# Altium schematic sheet stm32g4.SchDoc
size A4; SheetNumber: 2; SheetTotal: 11
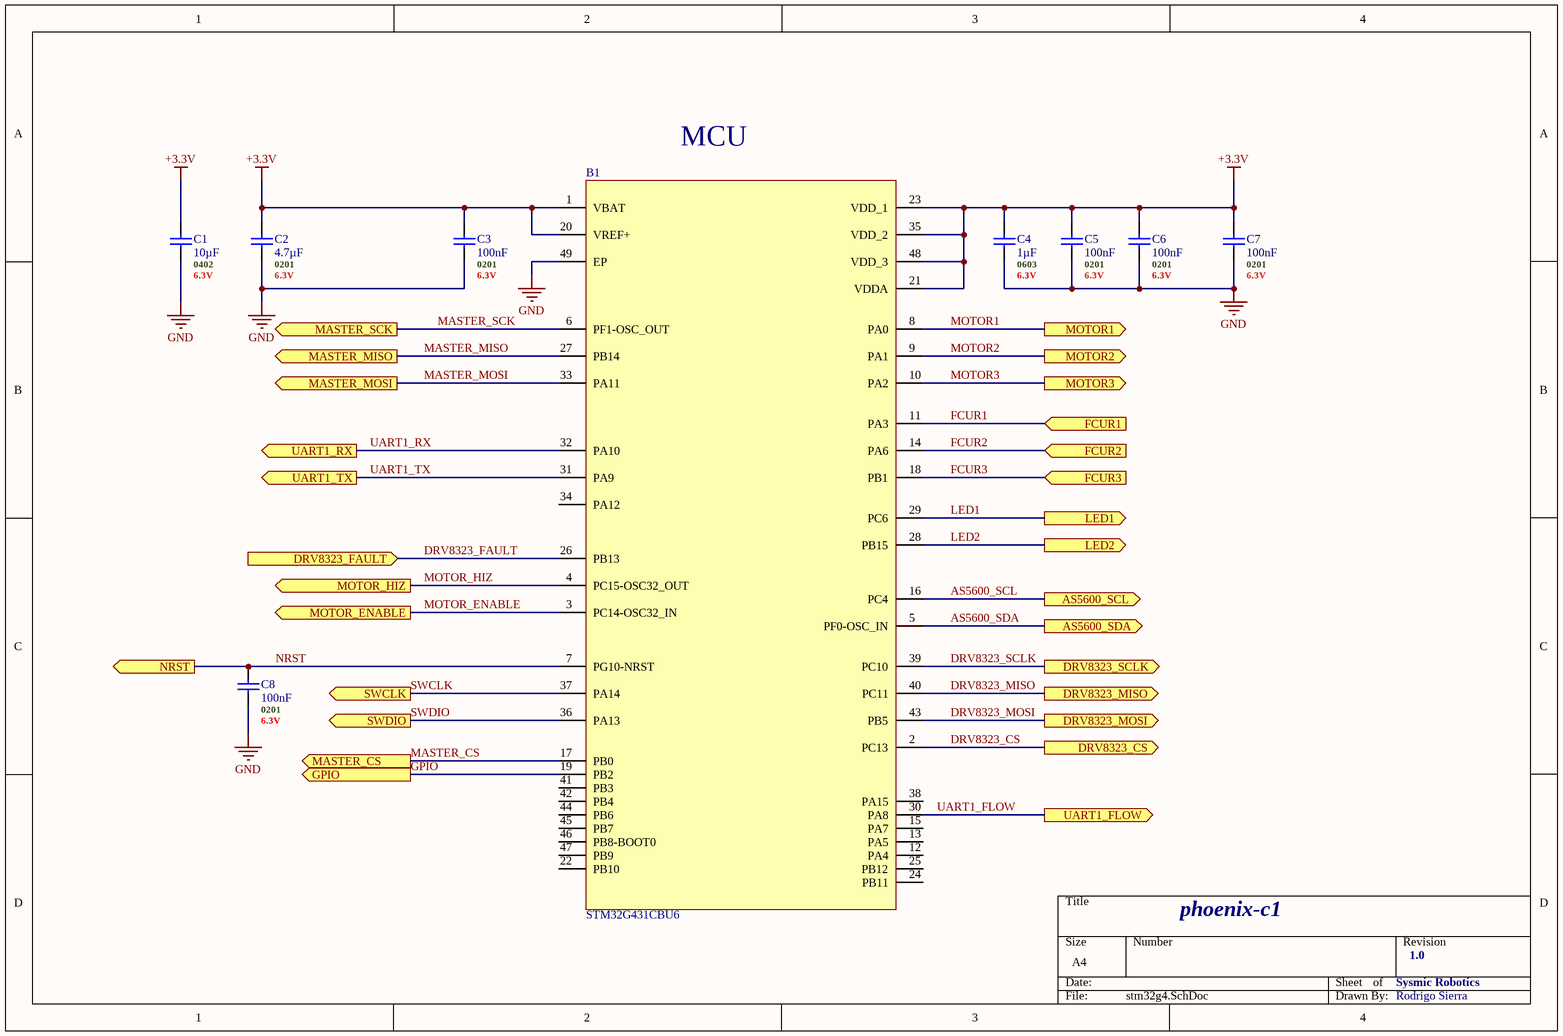
[diagram p0: stm32g4.SchDoc]

## Parts
B1  STM32G431CBU6  [48-UFQFN - STMicroelectronics]
C1  10µF  .Case/Package: 0402  .Voltage Rating (DC): 6.3V  [C0402 - MURATA]
C2  4.7µF  .Case/Package: 0201  .Voltage Rating (DC): 6.3V  [C0201 - MURATA]
C3  100nF  .Case/Package: 0201  .Voltage Rating (DC): 6.3V  [C0201 - MURATA]
C4  1µF  .Case/Package: 0603  .Voltage Rating (DC): 6.3V  [C0603 - MURATA]
C5  100nF  .Case/Package: 0201  .Voltage Rating (DC): 6.3V  [C0201 - MURATA]
C6  100nF  .Case/Package: 0201  .Voltage Rating (DC): 6.3V  [C0201 - MURATA]
C7  100nF  .Case/Package: 0201  .Voltage Rating (DC): 6.3V  [C0201 - MURATA]
C8  100nF  .Case/Package: 0201  .Voltage Rating (DC): 6.3V  [C0201 - MURATA]

## Ports
AS5600_SCL (out, see phoenix-c1-sch[2C], encoder[3B]), AS5600_SDA (out, see phoenix-c1-sch[2C], encoder[3B]), DRV8323_CS (out, see phoenix-c1-sch[3C], gate_driver[1C]), DRV8323_FAULT (in, see phoenix-c1-sch[3C], gate_driver[1C]), DRV8323_MISO (out, see phoenix-c1-sch[3B], gate_driver[1C]), DRV8323_MOSI (out, see phoenix-c1-sch[3C], gate_driver[1C]), DRV8323_SCLK (out, see phoenix-c1-sch[3C], gate_driver[1C]), FCUR1 (in, see phoenix-c1-sch[3C], gate_driver[4B]), FCUR2 (in, see phoenix-c1-sch[3C], gate_driver[4B]), FCUR3 (in, see phoenix-c1-sch[3C], gate_driver[4C]), GPIO (out, see phoenix-c1-sch[2B], external_ports[3C]), LED1 (out, see phoenix-c1-sch[2C], leds[2C]), LED2 (out, see phoenix-c1-sch[2C], leds[3C]), MASTER_CS (out, see phoenix-c1-sch[2B], external_ports[3C]), MASTER_MISO (out, see phoenix-c1-sch[2B], external_ports[3B]), MASTER_MOSI (out, see phoenix-c1-sch[2B], external_ports[3B]), MASTER_SCK (out, see phoenix-c1-sch[2B], external_ports[3B]), MOTOR1 (out, see phoenix-c1-sch[3B], gate_driver[1B]), MOTOR2 (out, see phoenix-c1-sch[3B], gate_driver[1B]), MOTOR3 (out, see phoenix-c1-sch[3B], gate_driver[1C]), MOTOR_ENABLE (out, see phoenix-c1-sch[3B], gate_driver[1B]), MOTOR_HIZ (out, see phoenix-c1-sch[3B], gate_driver[1B]), NRST (out, see phoenix-c1-sch[2B], external_ports[2C]), SWCLK (out, see phoenix-c1-sch[2B], external_ports[2B]), SWDIO (out, see phoenix-c1-sch[2B], external_ports[2C]), UART1_FLOW (out, see phoenix-c1-sch[2B], external_ports[4C]), UART1_RX (out, see phoenix-c1-sch[2B], external_ports[4B]), UART1_TX (out, see phoenix-c1-sch[2B], external_ports[4B])

## Nets
+3.3V: B1.1(VBAT) B1.20(VREF+) B1.21(VDDA) B1.23(VDD_1) B1.35(VDD_2) B1.48(VDD_3) C1.2 C2.2 C3.2 C4.2 C5.2 C6.2 C7.2
GND: B1.49(EP) C1.1 C2.1 C3.1 C4.1 C5.1 C6.1 C7.1 C8.1
AS5600_SCL: B1.16(PC4) ; port AS5600_SCL
AS5600_SDA: B1.5(PF0-OSC_IN) ; port AS5600_SDA
DRV8323_CS: B1.2(PC13) ; port DRV8323_CS
DRV8323_FAULT: B1.26(PB13) ; port DRV8323_FAULT
DRV8323_MISO: B1.40(PC11) ; port DRV8323_MISO
DRV8323_MOSI: B1.43(PB5) ; port DRV8323_MOSI
DRV8323_SCLK: B1.39(PC10) ; port DRV8323_SCLK
FCUR1: B1.11(PA3) ; port FCUR1
FCUR2: B1.14(PA6) ; port FCUR2
FCUR3: B1.18(PB1) ; port FCUR3
GPIO: B1.19(PB2) ; port GPIO
LED1: B1.29(PC6) ; port LED1
LED2: B1.28(PB15) ; port LED2
MASTER_CS: B1.17(PB0) ; port MASTER_CS
MASTER_MISO: B1.27(PB14) ; port MASTER_MISO
MASTER_MOSI: B1.33(PA11) ; port MASTER_MOSI
MASTER_SCK: B1.6(PF1-OSC_OUT) ; port MASTER_SCK
MOTOR1: B1.8(PA0) ; port MOTOR1
MOTOR2: B1.9(PA1) ; port MOTOR2
MOTOR3: B1.10(PA2) ; port MOTOR3
MOTOR_ENABLE: B1.3(PC14-OSC32_IN) ; port MOTOR_ENABLE
MOTOR_HIZ: B1.4(PC15-OSC32_OUT) ; port MOTOR_HIZ
NRST: B1.7(PG10-NRST) C8.2 ; port NRST
SWCLK: B1.37(PA14) ; port SWCLK
SWDIO: B1.36(PA13) ; port SWDIO
UART1_FLOW: B1.30(PA8) ; port UART1_FLOW
UART1_RX: B1.32(PA10) ; port UART1_RX
UART1_TX: B1.31(PA9) ; port UART1_TX

Not connected (* = marked no-connect by the designer): B1 12(PA4) 13(PA5) 15(PA7) 22(PB10) 24(PB11) 25(PB12) 34(PA12) 38(PA15) 41(PB3) 42(PB4) 44(PB6) 45(PB7) 46(PB8-BOOT0) 47(PB9)

## Notes on the sheet
- MCU
- phoenix-c1
- Sysmic Robotics
- 1.0
- Rodrigo Sierra

## Library data of the parts
B1 = STM32G431CBU6: STMICROELECTRONICS - STM32G431CBU6 - MCU, 32BIT, 170MHZ, UFQFPN-48; Geometry.Height: 0.65mm; Mouser Part Number: 511-STM32G431CBU6; Mouser Price/Stock: https://www.mouser.co.uk/ProductDetail/STMicroelectronics/STM32G431CBU6?qs=T3oQrply3y%252B0hTuSHQ7oqA%3D%3D; Manufacturer_Name: STMicroelectronics; Manufacturer_Part_Number: STM32G431CBU6; Datasheet Link: https://www.st.com/resource/en/datasheet/stm32g431cb.pdf; Supplier 1: Mouser; Supplier Part Number 1: 511-STM32G431CBU6
C1 = GRM155R60J106ME05D: Ceramic Capacitor, Ceramic, 6.3V, 20% +Tol, 20% -Tol, X5R, 15% TC, 10uF, Surface Mount, 0402; Manufacturer: Murata; Manufacturer Lifecycle Status: IN PRODUCTION; Supplier: Mouser; Supplier Part Number: 81-GRM155R60J106M05D; Manufacturer Part Number: GRM155R60J106ME05D; RoHS: Compliant; Category: Ceramic Capacitors; Stock: 374888; Pricing: 1=0,1, 10=0,021, 50=0,021, 100=0,019, 1000=0,018, 10000=0,014 (USD); Value: 10µF; Case/Package: 0402; Dielectric: X5R; Dielectric Material: Ceramic; Height: 500µm; Length: 1mm; Lifecycle Status: Production; Material: Ceramic; Max Operating Temperature: 85°C; Min Operating Temperature: -55°C; Mounting Technology: Surface Mount; Number of Terminals: 2; REACH SVHC: Yes; Schedule B: 8532240020|8532240020|8532240020|8532240020|8532240020|8532240020|8532240020|8532240020|8532240020|8532240020|8532240020|8532240020|8532240020|8532240020|8532240020|8532240020|8532240020|8532240020|8532240020|8532240020|8532240020|8532240020|8532240020|85; Thickness: 500µm; Tolerance: 20%; Voltage Rating: 6.3V; Voltage Rating (DC): 6.3V; Width: 500µm; ComponentLink1URL: https://datasheet.octopart.com:443/GRM155R60J106ME05D-Murata-datasheet-155239051.pdf?src-supplier=Newark; ComponentLink1Description: https://datasheet.octopart.com:443/GRM155R60J106ME05D-Murata-datasheet-155239051.pdf?src-supplier=Newark; ComponentLink2URL: https://datasheet.octopart.com:443/GRM155R60J106ME05D-Murata-datasheet-165579666.pdf?src-supplier=TME; ComponentLink2Description: https://datasheet.octopart.com:443/GRM155R60J106ME05D-Murata-datasheet-165579666.pdf?src-supplier=TME; ComponentLink3URL: https://datasheet.octopart.com:443/GRM155R60J106ME05D-Murata-datasheet-141266224.pdf?src-supplier=Ciiva; ComponentLink3Description: https://datasheet.octopart.com:443/GRM155R60J106ME05D-Murata-datasheet-141266224.pdf?src-supplier=Ciiva; ComponentLink4URL: https://datasheet.octopart.com:443/GRM155R60J106ME05D-Murata-datasheet-140689296.pdf?src-supplier=Ciiva; ComponentLink4Description: https://datasheet.octopart.com:443/GRM155R60J106ME05D-Murata-datasheet-140689296.pdf?src-supplier=Ciiva; ComponentLink5URL: https://datasheet.octopart.com:443/GRM155R60J106ME05D-Murata-datasheet-138740637.pdf?src-supplier=Ciiva; ComponentLink5Description: https://datasheet.octopart.com:443/GRM155R60J106ME05D-Murata-datasheet-138740637.pdf?src-supplier=Ciiva; ComponentLink6URL: https://datasheet.octopart.com/GRM155R60J106ME05D-Murata-datasheet-12515295.pdf; ComponentLink6Description: https://datasheet.octopart.com/GRM155R60J106ME05D-Murata-datasheet-12515295.pdf; ComponentLink7URL: https://datasheet.octopart.com/GRM155R60J106ME05D-Murata-datasheet-12510076.pdf; ComponentLink7Description: https://datasheet.octopart.com/GRM155R60J106ME05D-Murata-datasheet-12510076.pdf; ComponentLink8URL: https://datasheet.octopart.com/GRM155R60J106ME05D-Murata-datasheet-11978611.pdf; ComponentLink8Description: https://datasheet.octopart.com/GRM155R60J106ME05D-Murata-datasheet-11978611.pdf; ComponentLink9URL: https://datasheet.octopart.com/GRM155R60J106ME05D-Murata-datasheet-10025737.pdf; ComponentLink9Description: https://datasheet.octopart.com/GRM155R60J106ME05D-Murata-datasheet-10025737.pdf; ComponentLink10URL: https://datasheet.octopart.com/GRM155R60J106ME05D-Murata-datasheet-8819587.pdf; ComponentLink10Description: https://datasheet.octopart.com/GRM155R60J106ME05D-Murata-datasheet-8819587.pdf; ComponentLink11URL: http://sigma.octopart.com:80/reach_statement/Murata-company-16.pdf?src-supplier=Compliance+Statements; ComponentLink11Description: http://sigma.octopart.com:80/reach_statement/Murata-company-16.pdf?src-supplier=Compliance+Statements; Supplier 1: Mouser; Supplier Part Number 1: 81-GRM155R60J106M05D
C2 = GRM035R60J475ME15D: Ceramic Capacitor, Ceramic, 6.3V, 20% +Tol, 20% -Tol, X5R, 15% TC, 4.7uF, Surface Mount, 0201; Manufacturer: Murata; Manufacturer Lifecycle Status: IN PRODUCTION; Supplier: Mouser; Supplier Part Number: 81-GRM035R60J475ME5D; Manufacturer Part Number: GRM035R60J475ME15D; RoHS: Compliant; Category: Ceramic Capacitors; Stock: 788914; Pricing: 1=0,1, 10=0,039, 50=0,039, 100=0,039, 1000=0,039, 10000=0,033 (USD); Value: 4.7µF; Case/Package: 0201; Case Code (Imperial): 0201; Case Code (Metric): 0603; Dielectric: X5R; Dielectric Material: Ceramic; Height: 500µm; Length: 600µm; Lifecycle Status: Production; Material: Ceramic; Max Operating Temperature: 85°C; Min Operating Temperature: -55°C; Mounting Technology: Surface Mount; Number of Terminals: 2; REACH SVHC: Yes; Schedule B: 8532240020, 8532240020|8532240020, 8532240020|8532240020|8532240020, 8532240020|8532240020|8532240020|8532240020; Thickness: 500µm; Tolerance: 20%; Voltage Rating: 6.3V; Voltage Rating (DC): 6.3V; Width: 300µm; ComponentLink1URL: https://datasheet.octopart.com:443/GRM035R60J475ME15D-Murata-datasheet-149522819.pdf?src-supplier=Farnell; ComponentLink1Description: https://datasheet.octopart.com:443/GRM035R60J475ME15D-Murata-datasheet-149522819.pdf?src-supplier=Farnell; ComponentLink2URL: https://datasheet.octopart.com:443/GRM035R60J475ME15D-Murata-datasheet-165579666.pdf?src-supplier=TME; ComponentLink2Description: https://datasheet.octopart.com:443/GRM035R60J475ME15D-Murata-datasheet-165579666.pdf?src-supplier=TME; ComponentLink3URL: https://datasheet.octopart.com:443/GRM035R60J475ME15D-Murata-datasheet-140678601.pdf?src-supplier=Ciiva; ComponentLink3Description: https://datasheet.octopart.com:443/GRM035R60J475ME15D-Murata-datasheet-140678601.pdf?src-supplier=Ciiva; ComponentLink4URL: https://datasheet.octopart.com:443/GRM035R60J475ME15D-Murata-datasheet-140677062.pdf?src-supplier=Ciiva; ComponentLink4Description: https://datasheet.octopart.com:443/GRM035R60J475ME15D-Murata-datasheet-140677062.pdf?src-supplier=Ciiva; ComponentLink5URL: https://datasheet.octopart.com:443/GRM035R60J475ME15D-Murata-datasheet-138738751.pdf?src-supplier=Ciiva; ComponentLink5Description: https://datasheet.octopart.com:443/GRM035R60J475ME15D-Murata-datasheet-138738751.pdf?src-supplier=Ciiva; ComponentLink6URL: https://datasheet.octopart.com:443/GRM035R60J475ME15D-Murata-datasheet-140089765.pdf?src-supplier=Future+Electronics; ComponentLink6Description: https://datasheet.octopart.com:443/GRM035R60J475ME15D-Murata-datasheet-140089765.pdf?src-supplier=Future+Electronics; ComponentLink7URL: https://datasheet.octopart.com/GRM035R60J475ME15D-Murata-datasheet-12515295.pdf; ComponentLink7Description: https://datasheet.octopart.com/GRM035R60J475ME15D-Murata-datasheet-12515295.pdf; ComponentLink8URL: https://datasheet.octopart.com/GRM035R60J475ME15D-Murata-datasheet-12510076.pdf; ComponentLink8Description: https://datasheet.octopart.com/GRM035R60J475ME15D-Murata-datasheet-12510076.pdf; ComponentLink9URL: https://datasheet.octopart.com/GRM035R60J475ME15D-Murata-datasheet-11978611.pdf; ComponentLink9Description: https://datasheet.octopart.com/GRM035R60J475ME15D-Murata-datasheet-11978611.pdf; ComponentLink10URL: https://datasheet.octopart.com/GRM035R60J475ME15D-Murata-datasheet-10025737.pdf; ComponentLink10Description: https://datasheet.octopart.com/GRM035R60J475ME15D-Murata-datasheet-10025737.pdf; ComponentLink11URL: https://datasheet.octopart.com/GRM035R60J475ME15D-Murata-datasheet-8819587.pdf; ComponentLink11Description: https://datasheet.octopart.com/GRM035R60J475ME15D-Murata-datasheet-8819587.pdf; ComponentLink12URL: http://sigma.octopart.com:80/reach_statement/Murata-company-16.pdf?src-supplier=Compliance+Statements; ComponentLink12Description: http://sigma.octopart.com:80/reach_statement/Murata-company-16.pdf?src-supplier=Compliance+Statements; Supplier 1: Mouser; Supplier Part Number 1: 81-GRM035R60J475ME5D
C3 C5-C8 = GRT033R60J104KE01J: Ceramic Capacitor, Multilayer, Ceramic, 6.3V, 10% +Tol, 10% -Tol, X5R, 15% TC, 0.1uF, Surface Mount, 0201; Manufacturer: Murata; Manufacturer Lifecycle Status: IN PRODUCTION; Supplier: Mouser; Supplier Part Number: 81-GRT033R60J104KE1J; Manufacturer Part Number: GRT033R60J104KE01J; RoHS: Compliant; Category: Ceramic Capacitors; Stock: 150000; Pricing: 1=0,1, 10=0,017, 50=0,017, 100=0,014, 1000=0,009, 10000=0,007 (USD); Value: 100nF; Case/Package: 0201; Dielectric Material: Ceramic; Height: 300µm; Length: 600µm; Lifecycle Status: Production; Material: Ceramic; Max Operating Temperature: 85°C; Min Operating Temperature: -55°C; Mounting Technology: Surface Mount; Number of Terminals: 2; REACH SVHC: Yes; Thickness: 300µm; Tolerance: 10%; Voltage Rating: 6.3V; Voltage Rating (DC): 6.3V; Width: 300µm; ComponentLink1URL: https://datasheet.octopart.com:443/GRT033R60J104KE01J-Murata-datasheet-141283033.pdf?src-supplier=Geoflip; ComponentLink1Description: https://datasheet.octopart.com:443/GRT033R60J104KE01J-Murata-datasheet-141283033.pdf?src-supplier=Geoflip; ComponentLink2URL: https://datasheet.octopart.com:443/GRT033R60J104KE01J-Murata-datasheet-140710645.pdf?src-supplier=Ciiva; ComponentLink2Description: https://datasheet.octopart.com:443/GRT033R60J104KE01J-Murata-datasheet-140710645.pdf?src-supplier=Ciiva; ComponentLink3URL: https://datasheet.octopart.com:443/GRT033R60J104KE01J-Murata-datasheet-138748272.pdf?src-supplier=Ciiva; ComponentLink3Description: https://datasheet.octopart.com:443/GRT033R60J104KE01J-Murata-datasheet-138748272.pdf?src-supplier=Ciiva; ComponentLink4URL: http://sigma.octopart.com:80/reach_statement/Murata-company-16.pdf?src-supplier=Compliance+Statements; ComponentLink4Description: http://sigma.octopart.com:80/reach_statement/Murata-company-16.pdf?src-supplier=Compliance+Statements; Supplier 1: Mouser; Supplier Part Number 1: 81-GRT033R60J104KE1J
C4 = GRM188R60J105KA01D: Ceramic Capacitor, Ceramic, 6.3V, 10% +Tol, 10% -Tol, X5R, 15% TC, 1uF, Surface Mount, 0603; Manufacturer: Murata; Manufacturer Lifecycle Status: NRND; Insulation Resistance: 500MΩ; Supplier: Mouser; Supplier Part Number: 81-GRM39R105K6.3; Manufacturer Part Number: GRM188R60J105KA01D; RoHS: Compliant; Category: Ceramic Capacitors; Stock: 153012; Pricing: 1=0,14, 10=0,056, 50=0,056, 100=0,049, 1000=0,035, 10000=0,019 (USD); Value: 1µF; Case/Package: 0603; Case Code (Imperial): 0603; Case Code (Metric): 1608; Depth: 800µm; Dielectric: X5R; Dielectric Material: Ceramic; Height: 800µm; Lead Free: Lead Free; Length: 1.6mm; Lifecycle Status: NRND; Material: Ceramic; Max Operating Temperature: 85°C; Min Operating Temperature: -55°C; Mounting Technology: Surface Mount; Pins: 2; Number of Terminals: 2; Radiation Hardening: No; REACH SVHC: Yes; Schedule B: 8532240020, 8532240020|8532240020, 8532240020|8532240020|8532240020, 8532240020|8532240020|8532240020|8532240020; Termination: SMD/SMT; Thickness: 800µm; Tolerance: 10%; Voltage: 6.3V; Voltage Rating: 6.3V; Voltage Rating (DC): 6.3V; Width: 800µm; ComponentLink1URL: https://datasheet.octopart.com:443/GRM188R60J105KA01D-Murata-datasheet-7599024.pdf?src-supplier=Newark; ComponentLink1Description: https://datasheet.octopart.com:443/GRM188R60J105KA01D-Murata-datasheet-7599024.pdf?src-supplier=Newark; ComponentLink2URL: https://datasheet.octopart.com:443/GRM188R60J105KA01D-Murata-datasheet-101584256.pdf?src-supplier=element14+APAC; ComponentLink2Description: https://datasheet.octopart.com:443/GRM188R60J105KA01D-Murata-datasheet-101584256.pdf?src-supplier=element14+APAC; ComponentLink3URL: https://datasheet.octopart.com:443/GRM188R60J105KA01D-Murata-datasheet-49135294.pdf?src-supplier=element14+APAC; ComponentLink3Description: https://datasheet.octopart.com:443/GRM188R60J105KA01D-Murata-datasheet-49135294.pdf?src-supplier=element14+APAC; ComponentLink4URL: https://datasheet.octopart.com:443/GRM188R60J105KA01D-Murata-datasheet-165579666.pdf?src-supplier=TME; ComponentLink4Description: https://datasheet.octopart.com:443/GRM188R60J105KA01D-Murata-datasheet-165579666.pdf?src-supplier=TME; ComponentLink5URL: https://datasheet.octopart.com:443/GRM188R60J105KA01D-Murata-datasheet-59876780.pdf?src-supplier=TME; ComponentLink5Description: https://datasheet.octopart.com:443/GRM188R60J105KA01D-Murata-datasheet-59876780.pdf?src-supplier=TME; ComponentLink6URL: https://datasheet.octopart.com:443/GRM188R60J105KA01D-Murata-datasheet-140704005.pdf?src-supplier=Ciiva; ComponentLink6Description: https://datasheet.octopart.com:443/GRM188R60J105KA01D-Murata-datasheet-140704005.pdf?src-supplier=Ciiva; ComponentLink7URL: https://datasheet.octopart.com:443/GRM188R60J105KA01D-Murata-datasheet-138742778.pdf?src-supplier=Ciiva; ComponentLink7Description: https://datasheet.octopart.com:443/GRM188R60J105KA01D-Murata-datasheet-138742778.pdf?src-supplier=Ciiva; ComponentLink8URL: https://datasheet.octopart.com:443/GRM188R60J105KA01D-Murata-datasheet-102370999.pdf?src-supplier=Future+Electronics; ComponentLink8Description: https://datasheet.octopart.com:443/GRM188R60J105KA01D-Murata-datasheet-102370999.pdf?src-supplier=Future+Electronics; ComponentLink9URL: https://datasheet.octopart.com:443/GRM188R60J105KA01D-Murata-datasheet-22122223.pdf?src-supplier=Future+Electronics; ComponentLink9Description: https://datasheet.octopart.com:443/GRM188R60J105KA01D-Murata-datasheet-22122223.pdf?src-supplier=Future+Electronics; ComponentLink10URL: https://datasheet.octopart.com:443/GRM188R60J105KA01D-Murata-datasheet-14400986.pdf?src-supplier=Future+Electronics; ComponentLink10Description: https://datasheet.octopart.com:443/GRM188R60J105KA01D-Murata-datasheet-14400986.pdf?src-supplier=Future+Electronics; ComponentLink11URL: https://datasheet.octopart.com:443/GRM188R60J105KA01D-Murata-datasheet-44107491.pdf?src-supplier=Future+Electronics; ComponentLink11Description: https://datasheet.octopart.com:443/GRM188R60J105KA01D-Murata-datasheet-44107491.pdf?src-supplier=Future+Electronics; ComponentLink12URL: https://datasheet.octopart.com/GRM188R60J105KA01D-Murata-datasheet-12515295.pdf; ComponentLink12Description: https://datasheet.octopart.com/GRM188R60J105KA01D-Murata-datasheet-12515295.pdf; ComponentLink13URL: https://datasheet.octopart.com/GRM188R60J105KA01D-Murata-datasheet-12510076.pdf; ComponentLink13Description: https://datasheet.octopart.com/GRM188R60J105KA01D-Murata-datasheet-12510076.pdf; ComponentLink14URL: https://datasheet.octopart.com/GRM188R60J105KA01D-Murata-datasheet-11978611.pdf; ComponentLink14Description: https://datasheet.octopart.com/GRM188R60J105KA01D-Murata-datasheet-11978611.pdf; ComponentLink15URL: https://datasheet.octopart.com/GRM188R60J105KA01D-Murata-datasheet-10025737.pdf; ComponentLink15Description: https://datasheet.octopart.com/GRM188R60J105KA01D-Murata-datasheet-10025737.pdf; ComponentLink16URL: https://datasheet.octopart.com/GRM188R60J105KA01D-Murata-datasheet-8819587.pdf; ComponentLink16Description: https://datasheet.octopart.com/GRM188R60J105KA01D-Murata-datasheet-8819587.pdf; ComponentLink17URL: https://datasheet.octopart.com/GRM188R60J105KA01D-Murata-datasheet-14401024.pdf; ComponentLink17Description: https://datasheet.octopart.com/GRM188R60J105KA01D-Murata-datasheet-14401024.pdf; ComponentLink18URL: https://datasheet.octopart.com:443/GRM188R60J105KA01D-Murata-datasheet-102.pdf?src-supplier=DigiKey; ComponentLink18Description: https://datasheet.octopart.com:443/GRM188R60J105KA01D-Murata-datasheet-102.pdf?src-supplier=DigiKey; ComponentLink19URL: https://datasheet.octopart.com:443/GRM188R60J105KA01D-Murata-datasheet-112596.pdf?src-supplier=Sierra+IC; ComponentLink19Description: https://datasheet.octopart.com:443/GRM188R60J105KA01D-Murata-datasheet-112596.pdf?src-supplier=Sierra+IC; ComponentLink20URL: https://datasheet.octopart.com:443/GRM188R60J105KA01D-Murata-datasheet-516848.pdf?src-supplier=Farnell; ComponentLink20Description: https://datasheet.octopart.com:443/GRM188R60J105KA01D-Murata-datasheet-516848.pdf?src-supplier=Farnell; ComponentLink21URL: http://sigma.octopart.com:80/reach_statement/Murata-company-16.pdf?src-supplier=Compliance+Statements; ComponentLink21Description: http://sigma.octopart.com:80/reach_statement/Murata-company-16.pdf?src-supplier=Compliance+Statements; Supplier 1: Mouser; Supplier Part Number 1: 81-GRM39R105K6.3